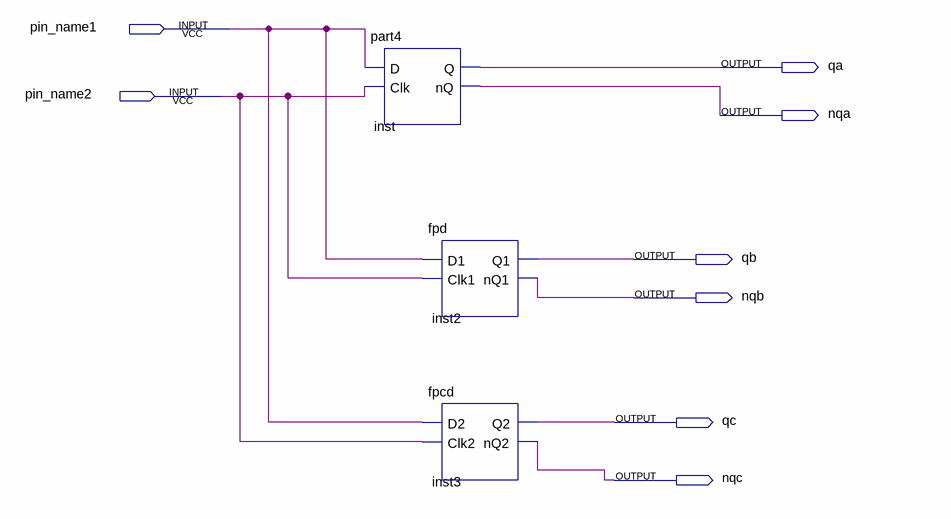
[diagram p0: schematic sheet]
// Quartus schematic parte4blck.bdf as structural Verilog: 3 symbols, 8 pins
module parte4blck (
  input  pin_name1,
  input  pin_name2,
  output qa,
  output nqa,
  output qb,
  output nqb,
  output qc,
  output nqc
);

  part4 inst (.D(pin_name1), .Clk(pin_name2), .Q(qa), .nQ(nqa));
  fpd inst2 (.D1(pin_name1), .Clk1(pin_name2), .Q1(qb), .nQ1(nqb));
  fpcd inst3 (.D2(pin_name1), .Clk2(pin_name2), .Q2(qc), .nQ2(nqc));
endmodule
